# EAGLE design en76-vco2 (EAGLE 6.6.0)
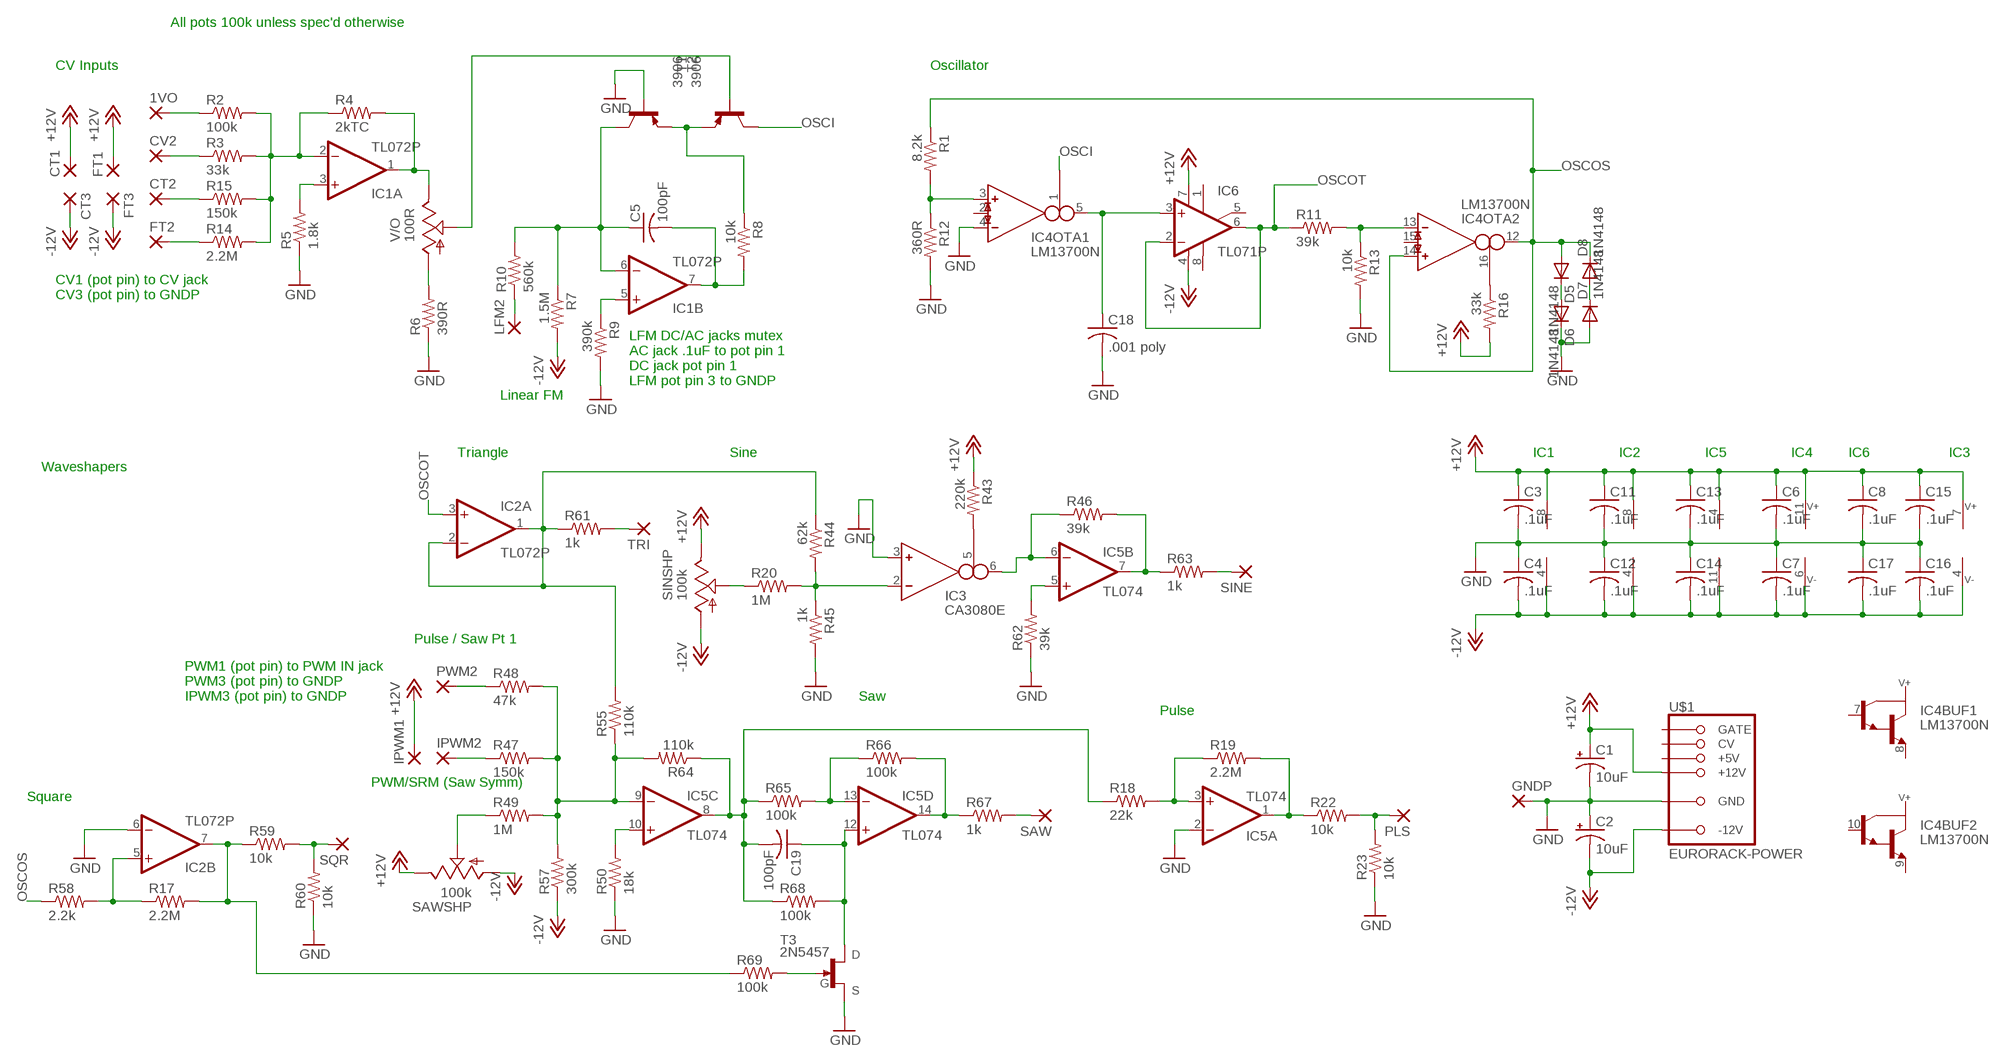
[diagram p0: schematic, sheet 1]

## Parts
1VO  2,54/1,0  [2,54/1,0]
C1  10uF  CPOL-USE2-5  [E2-5]
C2  10uF  CPOL-USE2-5  [E2-5]
C3  .1uF  C-US050-025X075  [C050-025X075]
C4  .1uF  C-US050-025X075  [C050-025X075]
C5  100pF  C-US050-025X075  [C050-025X075]
C6  .1uF  C-US050-025X075  [C050-025X075]
C7  .1uF  C-US050-025X075  [C050-025X075]
C8  .1uF  C-US050-025X075  [C050-025X075]
C11  .1uF  C-US050-025X075  [C050-025X075]
C12  .1uF  C-US050-025X075  [C050-025X075]
C13  .1uF  C-US050-025X075  [C050-025X075]
C14  .1uF  C-US050-025X075  [C050-025X075]
C15  .1uF  C-US050-025X075  [C050-025X075]
C16  .1uF  C-US050-025X075  [C050-025X075]
C17  .1uF  C-US050-025X075  [C050-025X075]
C18  .001 poly  C-US050-025X075  [C050-025X075]
C19  100pF  C-US050-025X075  [C050-025X075]
CT1  2,54/1,0  [2,54/1,0]
CT2  2,54/1,0  [2,54/1,0]
CT3  2,54/1,0  [2,54/1,0]
CV2  2,54/1,0  [2,54/1,0]
D5  1N4148  1N4148DO35-7  [DO35-7]
D6  1N4148  1N4148DO35-7  [DO35-7]
D7  1N4148  1N4148DO35-7  [DO35-7]
D8  1N4148  1N4148DO35-7  [DO35-7]
FT1  2,54/1,0  [2,54/1,0]
FT2  2,54/1,0  [2,54/1,0]
FT3  2,54/1,0  [2,54/1,0]
GNDP  2,54/1,0  [2,54/1,0]
IC1  TL072P  [DIL08]
IC2  TL072P  [DIL08]
IC3  CA3080E  [DIL08]
IC4  LM13700N  [DIL16]
IC5  TL074  TL074-TOPP  [DIL14]
IC6  TL071P  [DIL08]
IPWM1  2,54/1,0  [2,54/1,0]
IPWM2  2,54/1,0  [2,54/1,0]
LFM2  2,54/1,0  [2,54/1,0]
PLS  2,54/1,0  [2,54/1,0]
PWM2  2,54/1,0  [2,54/1,0]
R1  8.2k  R-US_0207/10  [0207/10]
R2  100k  R-US_0207/10  [0207/10]
R3  33k  R-US_0207/10  [0207/10]
R4  2kTC  R-US_0207/10  [0207/10]
R5  1.8k  R-US_0207/10  [0207/10]
R6  390R  R-US_0207/10  [0207/10]
R7  1.5M  R-US_0207/10  [0207/10]
R8  10k  R-US_0207/10  [0207/10]
R9  390k  R-US_0207/10  [0207/10]
R10  560k  R-US_0207/10  [0207/10]
R11  39k  R-US_0207/10  [0207/10]
R12  360R  R-US_0207/10  [0207/10]
R13  10k  R-US_0207/10  [0207/10]
R14  2.2M  R-US_0207/10  [0207/10]
R15  150k  R-US_0207/10  [0207/10]
R16  33k  R-US_0207/10  [0207/10]
R17  2.2M  R-US_0207/10  [0207/10]
R18  22k  R-US_0207/10  [0207/10]
R19  2.2M  R-US_0207/10  [0207/10]
R20  1M  R-US_0207/10  [0207/10]
R22  10k  R-US_0207/10  [0207/10]
R23  10k  R-US_0207/10  [0207/10]
R43  220k  R-US_0207/10  [0207/10]
R44  62k  R-US_0207/10  [0207/10]
R45  1k  R-US_0207/10  [0207/10]
R46  39k  R-US_0207/10  [0207/10]
R47  150k  R-US_0207/10  [0207/10]
R48  47k  R-US_0207/10  [0207/10]
R49  1M  R-US_0207/10  [0207/10]
R50  18k  R-US_0207/10  [0207/10]
R55  110k  R-US_0207/10  [0207/10]
R57  300k  R-US_0207/10  [0207/10]
R58  2.2k  R-US_0207/10  [0207/10]
R59  10k  R-US_0207/10  [0207/10]
R60  10k  R-US_0207/10  [0207/10]
R61  1k  R-US_0207/10  [0207/10]
R62  39k  R-US_0207/10  [0207/10]
R63  1k  R-US_0207/10  [0207/10]
R64  110k  R-US_0207/10  [0207/10]
R65  100k  R-US_0207/10  [0207/10]
R66  100k  R-US_0207/10  [0207/10]
R67  1k  R-US_0207/10  [0207/10]
R68  100k  R-US_0207/10  [0207/10]
R69  100k  R-US_0207/10  [0207/10]
SAW  2,54/1,0  [2,54/1,0]
SAWSHP  100k  TRIM_US-RJ9W  [RJ9W]
SINE  2,54/1,0  [2,54/1,0]
SINSHP  100k  TRIM_US-RJ9W  [RJ9W]
SQR  2,54/1,0  [2,54/1,0]
T1  3906  2N3906-PNP-TO92-EBC  [TO92-EBC]
T2  3906  2N3906-PNP-TO92-EBC  [TO92-EBC]
T3  2N5457  [TO-92]
TRI  2,54/1,0  [2,54/1,0]
U$1  EURORACK-POWER  [PINSHRD_PTH_2X8]
V/O  100R  TRIM_US-RJ9W  [RJ9W]

## Nets
+12V: C1.+ C3.1 C6.1 C8.1 C11.1 C13.1 C15.1 CT1.1(P) FT1.1(P) IC1.8(P:V+) IC2.8(P:V+) IC3.7 IC4.11 IC5.4(P:V+) IC6.7(V+) IPWM1.1(P) R16.2 R43.1 SAWSHP.E SINSHP.E U$1.+12V@1(+12V) U$1.+12V@2(+12V)
-12V: C2.- C4.2 C7.2 C12.2 C14.2 C16.2 C17.2 CT3.1(P) FT3.1(P) IC1.4(P:V-) IC2.4(P:V-) IC3.4 IC4.6 IC5.11(P:V-) IC6.4(V-) R7.2 R57.1 SAWSHP.A SINSHP.A U$1.-12V@1(-12V) U$1.-12V@2(-12V)
GND: C1.- C2.+ C3.2 C4.1 C6.2 C7.1 C8.2 C11.2 C12.1 C13.2 C14.1 C15.2 C16.1 C17.1 C18.2 D6.C D7.A GNDP.1(P) IC2.6(B:-IN) IC3.3(IN_P) IC4.4(OTA1:IN_N) IC5.2(A:-IN) R5.1 R6.1 R9.2 R12.2 R13.2 R23.1 R45.2 R50.1 R60.1 R62.1 T2.B T3.2(S) U$1.GND@1(GND) U$1.GND@2(GND) U$1.GND@3(GND) U$1.GND@4(GND) U$1.GND@5(GND) U$1.GND@6(GND)
N$1: CT2.1(P) R15.1
N$2: CV2.1(P) R3.1
N$3: 1VO.1(P) R2.1
N$4: T1.B V/O.S
N$5: IC1.3(A:+IN) R5.2
N$6: IC1.2(A:-IN) R2.2 R3.2 R4.1 R14.2 R15.2
N$7: IC1.1(A:OUT) R4.2 V/O.E
N$8: R6.2 V/O.A
N$9: C5.1 IC1.6(B:-IN) R7.1 R10.2 T2.C
N$10: R8.1 T1.E T2.E
N$11: C5.2 IC1.7(B:OUT) R8.2
N$12: FT2.1(P) R14.1
N$13: LFM2.1(P) R10.1
N$14: IC1.5(B:+IN) R9.1
N$15: IC2.5(B:+IN) R17.1 R58.2
N$16: C18.1 IC4.5(OTA1:OUT) IC6.3(+IN)
N$17: IPWM2.1(P) R47.1
N$18: R59.2 R60.2 SQR.1(P)
N$19: IC5.9(C:-IN) R47.2 R48.2 R49.2 R55.1 R57.2 R64.2
N$20: IC4.3(OTA1:IN_P) R1.2 R12.1
N$21: IC4.13(OTA2:IN_N) R11.2 R13.1
N$22: R20.1 SINSHP.S
N$23: IC5.3(A:+IN) R18.2 R19.1
N$24: IC5.1(A:OUT) R19.2 R22.1
N$38: IC3.5(I_BIAS) R43.2
N$39: IC3.6(OUT) IC5.6(B:-IN) R46.1
N$40: IC3.2(IN_N) R20.2 R44.2 R45.1
N$43: PWM2.1(P) R48.1
N$44: R49.1 SAWSHP.S
N$45: IC5.10(C:+IN) R50.2
N$51: C19.2 IC5.8(C:OUT) R18.1 R64.1 R65.1 R68.1
N$52: IC4.16(OTA2:I_BIAS) R16.1
N$53: IC5.13(D:-IN) R65.2 R66.1
N$55: R61.2 TRI.1(P)
N$56: D5.C D6.A
N$57: D7.C D8.A
N$58: IC5.7(B:OUT) R46.2 R63.1
N$59: IC5.5(B:+IN) R62.2
N$60: R63.2 SINE.1(P)
N$61: R67.2 SAW.1(P)
N$62: IC5.14(D:OUT) R66.2 R67.1
N$63: C19.1 IC5.12(D:+IN) R68.2 T3.1(D)
N$64: R69.2 T3.3(G)
N$65: PLS.1(P) R22.2 R23.2
OSCI: IC4.1(OTA1:I_BIAS) T1.C
OSCOS: D5.A D8.C IC4.12(OTA2:OUT) IC4.14(OTA2:IN_P) R1.1 R58.1
OSCOT: IC2.3(A:+IN) IC6.2(-IN) IC6.6(OUT) R11.1
SQX: IC2.7(B:OUT) R17.2 R59.1 R69.1
TRIANGLE: IC2.1(A:OUT) IC2.2(A:-IN) R44.1 R55.2 R61.1
Unconnected: IC4.2(OTA1:I_DIODE) IC4.7(BUF1:B) IC4.8(BUF1:E) IC4.9(BUF2:E) IC4.10(BUF2:B) IC4.15(OTA2:I_DIODE) IC6.1(ON1) IC6.5(ON2) IC6.8(OPT) U$1.+5V@1(+5V) U$1.+5V@2(+5V) U$1.CV@1(CV) U$1.CV@2(CV) U$1.GATE@1(GATE) U$1.GATE@2(GATE)

## Notes on the sheet
- All pots 100k unless spec'd otherwise
- CV Inputs | Oscillator
- CV1 (pot pin) to CV jack
  CV3 (pot pin) to GNDP
- LFM DC/AC jacks mutex
  AC jack .1uF to pot pin 1
  DC jack pot pin 1
  LFM pot pin 3 to GNDP
- Linear FM
- Triangle | Sine | IC1 | IC2 | IC5 | IC4 | IC6 | IC3
- Waveshapers
- Pulse / Saw Pt 1
- PWM1 (pot pin) to PWM IN jack
  PWM3 (pot pin) to GNDP
  IPWM3 (pot pin) to GNDP
- Saw
- Pulse
- PWM/SRM (Saw Symm)
- Square

## Library data of the parts
1VO CT1-CT3 CV2 FT1-FT3 GNDP IPWM1 IPWM2 LFM2 PLS PWM2 SAW SINE SQR TRI = wirepad:2,54/1,0: THROUGH-HOLE PAD
C1 C2 = rcl:CPOL-US: POLARIZED CAPACITOR, American symbol
C3-C8 C11-C19 = rcl:C-US: CAPACITOR, American symbol
D5-D8 = diode:1N4148: DIODE high speed (Philips)
IC1 IC2 = mmoretti:TL072: OP AMP
IC3 = mmoretti:CA3080: OTA
IC4 = mmoretti:LM13700: Dual OTA with buffers
IC5 = mmoretti:TL074-TOP: OP AMP
IC6 = mmoretti:TL071: OP AMP
R1-R20 R22 R23 R43-R50 R55 R57-R69 = rcl:R-US_: RESISTOR, American symbol
SAWSHP SINSHP V/O = pot:TRIM_US-: POTENTIOMETER
T1 T2 = transistor-neu-to92:*-PNP-: PNP Transistror
T3 = transistors-random:2N54*: 2N54xx N-channel JFET
U$1 = mmoretti:EURORACK-POWER

## Board
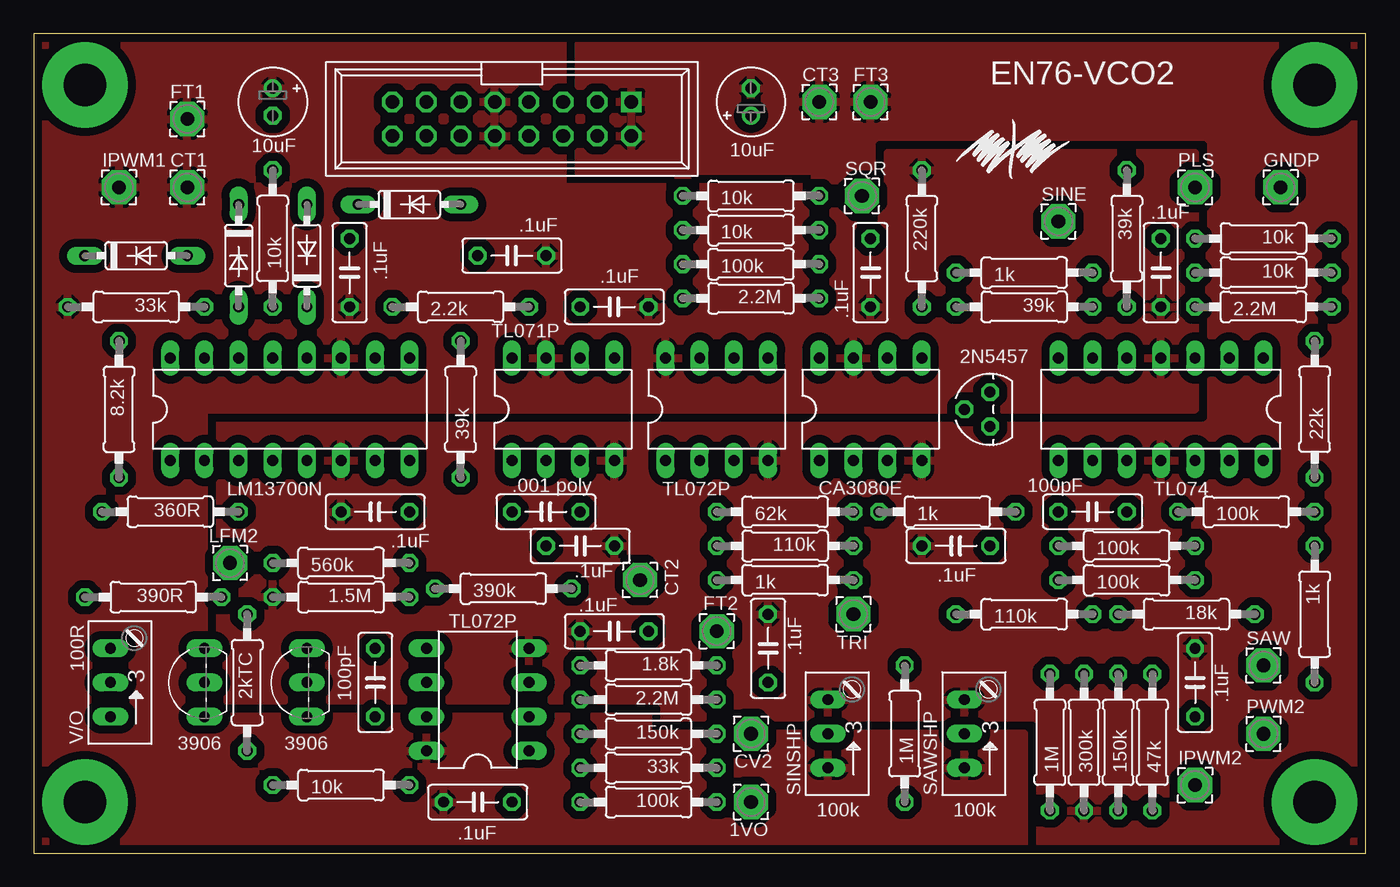
[diagram p1: board, top side]
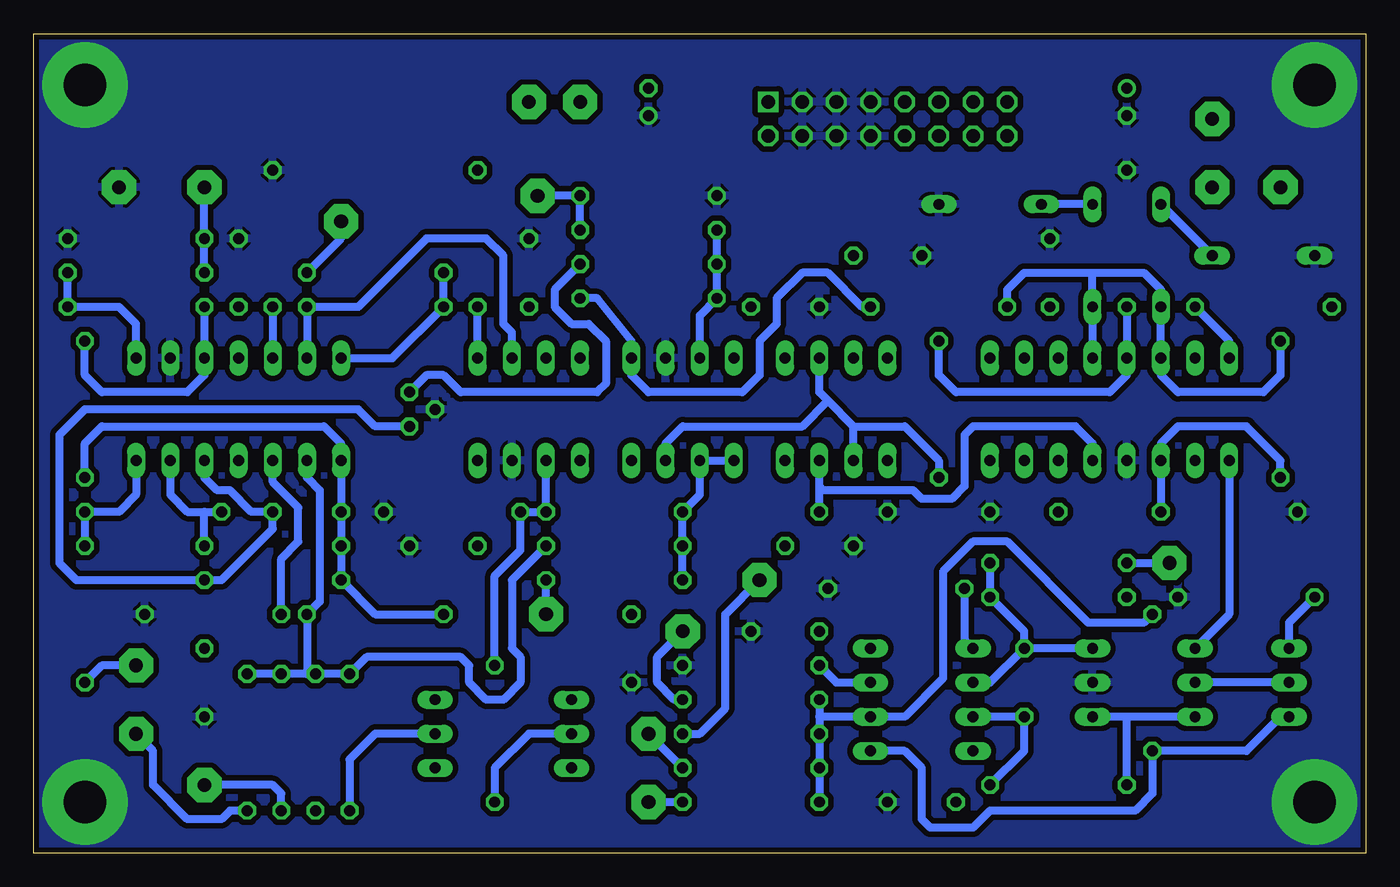
[diagram p2: board, bottom side, seen from below]

Size 99.06 x 60.96 mm. Coordinates in mm from the lower left corner, seen from the top.
Outline: 0,0 99.04,0 99.06,60.96 0,60.96 0,0
Copper layers (1*16): Top 0.035mm / dielectric 1.5mm / Bottom 0.035mm
Design rules "SeeedStudio_2layer_DRU_no_angle_20140221": minimum track width 6mil, minimum drill 12mil, track to track 6mil, track to pad 6mil, pad to pad 6mil, via to via 6mil, smd to smd 0mil, copper to edge 10mil, drill to drill 10mil, minimum pad ring 10mil, minimum via ring 6mil, stop-mask expansion 2mil, vias tented up to drill 100mil, thermal gap 10mil

### Footprints (pad centres in the part's own frame; a part is rotated, then mirrored left to right if it is on the bottom)
2,54/1,0 = drill 1.016 pad 2.54 octagon: 1 0,0
E2-5 = drill 0.813 pad 1.27: + -1.016,0 | drill 0.813 pad 1.27 octagon: - 1.016,0
C050-025X075 = drill 0.813 octagon: 1 -2.54,0; 2 2.54,0
DO35-7 = drill 0.813 long: A 3.81,0; C -3.81,0
DIL08 = drill 0.813 long: 1 -3.81,-3.81; 2 -1.27,-3.81; 3 1.27,-3.81; 4 3.81,-3.81; 5 3.81,3.81; 6 1.27,3.81; 7 -1.27,3.81; 8 -3.81,3.81
DIL16 = drill 0.813 long: 1 -8.89,-3.81; 2 -6.35,-3.81; 3 -3.81,-3.81; 4 -1.27,-3.81; 5 1.27,-3.81; 6 3.81,-3.81; 7 6.35,-3.81; 8 8.89,-3.81; 9 8.89,3.81; 10 6.35,3.81; 11 3.81,3.81; 12 1.27,3.81; 13 -1.27,3.81; 14 -3.81,3.81; 15 -6.35,3.81; 16 -8.89,3.81
DIL14 = drill 0.813 long: 1 -7.62,-3.81; 2 -5.08,-3.81; 3 -2.54,-3.81; 4 0,-3.81; 5 2.54,-3.81; 6 5.08,-3.81; 7 7.62,-3.81; 8 7.62,3.81; 9 5.08,3.81; 10 2.54,3.81; 11 0,3.81; 12 -2.54,3.81; 13 -5.08,3.81; 14 -7.62,3.81
0207/10 = drill 0.813 octagon: 1 -5.08,0; 2 5.08,0
RJ9W = drill 0.813 long: A 2.54,0.635; E -2.54,0.635; S 0,0.635
TO92-EBC = drill 0.813 long: B 0,-1.27; C 2.54,-1.27; E -2.54,-1.27
TO-92 = drill 0.813 octagon: 1 -1.27,0; 2 0,1.905; 3 1.27,0
PINSHRD_PTH_2X8 = drill 1.016 octagon: +5V@1 3.81,1.27; +5V@2 3.81,-1.27; +12V@1 1.27,1.27; +12V@2 1.27,-1.27; -12V@1 -8.89,1.27; CV@1 6.35,1.27; CV@2 6.35,-1.27; GATE@1 8.89,1.27; GATE@2 8.89,-1.27; GND@1 -6.35,1.27; GND@2 -6.35,-1.27; GND@3 -3.81,1.27; GND@4 -3.81,-1.27; GND@5 -1.27,1.27; GND@6 -1.27,-1.27 | drill 1.016 square: -12V@2 -8.89,-1.27

### Placement (x,y rotation side)
1VO  53.34,3.81 180 top
C1  17.78,55.88 270 top
C2  53.34,55.88 90 top
C3  33.02,3.81 0 top
C4  43.18,16.51 180 top
C5  25.4,12.7 270 top
C6  23.5,43.18 90 top
C7  25.4,25.4 180 top
C8  35.56,44.45 180 top
C11  43.18,40.64 180 top
C12  54.61,15.24 90 top
C13  83.82,43.18 90 top
C14  86.36,12.7 90 top
C15  62.23,43.18 90 top
C16  68.58,22.86 180 top
C17  40.64,22.86 0 top
C18  38.1,25.4 180 top
C19  78.74,25.4 180 top
CT1  11.43,49.53 0 top
CT2  45.09,20.32 180 top
CT3  58.42,55.88 0 top
CV2  53.34,8.89 180 top
D5  15.24,44.45 270 top
D6  7.62,44.45 0 top
D7  27.94,48.26 0 top
D8  20.32,44.45 90 top
FT1  11.43,54.61 0 top
FT2  50.8,16.51 180 top
FT3  62.23,55.88 0 top
GNDP  92.71,49.53 0 top
IC1  33.02,11.43 90 top
IC2  50.8,33.02 0 top
IC3  62.23,33.02 0 top
IC4  19.05,33.02 0 top
IC5  83.82,33.02 180 top
IC6  39.37,33.02 0 top
IPWM1  6.35,49.53 0 top
IPWM2  86.36,5.08 0 top
LFM2  14.61,21.59 270 top
PLS  86.36,49.53 0 top
PWM2  91.44,8.89 0 top
R1  6.35,33.02 270 top
R2  45.72,3.81 180 top
R3  45.72,6.35 180 top
R4  15.88,12.7 270 top
R5  45.72,13.97 180 top
R6  8.89,19.05 180 top
R7  22.86,19.05 180 top
R8  22.86,5.08 0 top
R9  34.92,19.68 0 top
R10  22.86,21.59 0 top
R11  31.75,33.02 90 top
R12  10.16,25.4 180 top
R13  17.78,45.72 90 top
R14  45.72,11.43 180 top
R15  45.72,8.89 180 top
R16  7.62,40.64 180 top
R17  53.34,41.27 180 top
R18  95.25,33.02 90 top
R19  91.44,40.64 0 top
R20  64.77,8.89 90 top
R22  91.44,43.18 180 top
R23  91.44,45.72 180 top
R43  66.04,45.72 270 top
R44  55.88,25.4 0 top
R45  67.94,25.4 0 top
R46  73.66,40.64 180 top
R47  80.64,8.26 90 top
R48  83.19,8.26 90 top
R49  75.56,8.26 90 top
R50  85.72,17.78 180 top
R55  55.88,22.86 180 top
R57  78.11,8.26 90 top
R58  31.75,40.64 0 top
R59  53.34,46.35 0 top
R60  53.34,48.9 0 top
R61  55.88,20.32 0 top
R62  81.28,45.72 270 top
R63  73.66,43.18 0 top
R64  73.66,17.78 0 top
R65  81.28,22.86 0 top
R66  90.17,25.4 0 top
R67  95.25,17.78 270 top
R68  81.28,20.32 0 top
R69  53.34,43.81 0 top
SAW  91.44,13.97 0 top
SAWSHP  69.85,8.89 90 top
SINE  76.2,46.99 0 top
SINSHP  59.69,8.89 90 top
SQR  61.59,48.9 0 top
T1  11.43,12.7 90 top
T2  19.05,12.7 90 top
T3  71.12,33.02 90 top
TRI  60.96,17.78 0 top
U$1  35.56,54.61 180 top
V/O  6.35,12.7 90 top

### Tracks (layer width: path | path; a pad name or v marks a point on that pad's centre or on a via)
+12V
  pour Top (isolate 0.61): 0,60.96 0,0 73.66,0 73.66,8.89 45.72,8.89 45.72,10.16 12.7,10.16 12.7,33.02 86.36,33.02 86.36,52.07 63.5,52.07 63.5,49.53 39.37,49.53 39.37,60.96
-12V
  pour Top (isolate 0.61, rank 2): 39.37,60.96 99.06,60.96 99.06,0 73.66,0 73.66,8.89 45.72,8.89 45.72,10.16 12.7,10.16 12.7,33.02 86.36,33.02 86.36,52.07 63.5,52.07 63.5,49.53 39.37,49.53
GND  (via drill 3.17 pad 6.35)
  other vias: 3.81,57.15 3.81,3.81 95.25,57.15 95.25,3.81
  pour Bottom (isolate 0.406): 0,60.96 99.06,60.96 99.06,0 0,0
N$1
  Bottom 0.61: R15.1 49.53,8.89 47.62,10.79 47.62,17.78 CT2.1
N$2
  Bottom 0.61: R3.1 CV2.1
N$3
  Bottom 0.61: R2.1 1VO.1
N$4
  Bottom 0.61: V/O.S T1.B
N$5
  Bottom 0.61: R5.2 39.37,12.7 IC1.3
N$6
  Bottom 0.61: R4.1 16.51,17.14 20.64,17.14 26.67,23.18 29.21,23.18 31.43,20.95 31.43,13.02 34.29,10.16 IC1.2 40.64,10.16 | R14.2 40.64,10.16 | 40.64,10.16 R15.2 R3.2 R2.2
N$7
  Bottom 0.61: V/O.E 6.35,10.16 8.89,7.62 R4.2 15.88,4.45 17.14,3.17 27.94,3.17 29.21,1.91 32.38,1.91 33.02,2.54 33.02,6.35 34.29,7.62 IC1.1
N$8
  Bottom 0.61: R6.2 5.71,17.14 V/O.A
N$9
  Bottom 0.61: T2.C C5.1 | R10.2 R7.1 25.4,16.51 C5.1 | IC1.6 27.94,12.7 C5.1
N$10
  Bottom 0.61: T1.E 17.78,10.16 | 17.78,10.16 T2.E | R8.1 17.78,10.16
N$11
  Bottom 0.61: IC1.7 C5.2 25.4,7.62 R8.2
N$12
  Bottom 0.61: R14.1 51.44,11.43 52.7,12.7 52.7,14.61 FT2.1
N$13
  Bottom 0.61: R10.1 LFM2.1
N$14
  Bottom 0.61: R9.1 29.84,15.88 IC1.5
N$15
  Bottom 0.61: R58.2 37.47,40.64 40.01,43.18 41.91,43.18 43.81,41.27 43.81,39.37 45.09,38.1 45.09,35.56 46.35,34.29 53.34,34.29 54.61,35.56 IC2.5 54.61,38.1 57.15,41.27 R17.1
N$16
  Bottom 0.61: C18.1 40.64,27.3 | 40.64,27.3 IC6.3 | IC4.5 20.32,30.48 21.59,31.75 29.21,31.75 29.84,31.11 29.84,27.3 30.8,26.35 33.02,26.35 33.66,26.99 40.32,26.99 40.64,27.3
N$17
  Bottom 0.61: R47.1 80.64,4.45 81.28,5.08 IPWM2.1
N$18
  Bottom 0.61: R59.2 R60.2 SQR.1
N$19
  Bottom 0.61: R55.1 63.5,20.32 63.5,15.24 62.87,14.61 62.87,12.7 64.14,11.43 65.41,11.43 66.67,12.7 66.67,13.97 67.31,14.61 74.3,14.61 R49.2 R57.2 78.74,13.34 | 78.74,13.34 R47.2 R48.2 | 78.74,13.34 R64.2 77.79,18.73 77.79,26.99 78.74,27.94 IC5.9
N$20
  Bottom 0.61: R1.2 6.35,29.21 8.89,31.75 13.97,31.75 15.24,30.48 IC4.3 R12.1
N$21
  Bottom 0.61: R13.1 IC4.13 17.78,35.56 19.05,34.29 30.48,34.29 31.75,35.56 R11.2
N$22
  Bottom 0.61: SINSHP.S 62.23,8.89 64.77,6.35 R20.1
N$23
  Bottom 0.61: R19.1 IC5.3 86.36,35.56 87.63,34.29 93.98,34.29 95.25,35.56 R18.2
N$24
  Bottom 0.61: IC5.1 91.44,39.37 92.71,40.64 R19.2 R22.1
N$38
  Bottom 0.61: IC3.5 R43.2
N$39
  Bottom 0.61: IC3.6 63.5,38.73 64.14,39.37 64.14,44.45 65.41,45.72 69.85,45.72 74.93,40.64 R46.1 IC5.6
N$40
  Bottom 0.61: R20.2 64.77,20.64 62.87,22.54 R45.1 R44.2 IC3.2
N$43
  Bottom 0.61: R48.1 84.45,3.17 85.09,2.54 87.63,2.54 90.17,5.08 90.17,7.62 PWM2.1
N$44
  Bottom 0.61: SAWSHP.S 73.66,8.89 75.56,6.99 R49.1
N$45
  Bottom 0.61: R50.2 80.64,21.91 79.38,23.18 79.38,25.72 81.28,27.62 IC5.10
N$51
  Bottom 0.61: R18.1 95.25,30.48 93.98,31.75 77.47,31.75 76.2,30.48 IC5.8 C19.2 R65.1 R68.1 73.66,17.78 R64.1
N$52
  Bottom 0.61: IC4.16 10.16,38.1 R16.1
N$53
  Bottom 0.61: IC5.13 88.9,26.67 87.63,25.4 86.36,25.4 | 86.36,25.4 R66.1 | R65.2 86.36,25.4
N$55
  Bottom 0.61: TRI.1 R61.2
N$56
  Bottom 0.61: D5.C D6.A
N$57
  Bottom 0.61: D8.A D7.C
N$58
  Bottom 0.61: IC5.7 72.39,36.83 R46.2 R63.1
N$59
  Bottom 0.61: R62.2 IC5.5
N$60
  Bottom 0.61: R63.2 76.2,45.72 SINE.1
N$61
  Bottom 0.61: SAW.1 93.98,13.97 R67.2
N$62
  Bottom 0.61: IC5.14 91.44,26.67 92.71,25.4 R66.2 R67.1
N$63
  Bottom 0.61: IC5.12 86.36,27.94 85.41,26.99 84.45,26.99 82.87,25.4 C19.1 81.28,24.13 85.09,20.32 R68.2 95.89,20.32 97.16,21.59 97.16,31.11 95.25,33.02 74.93,33.02 73.66,31.75 T3.1
N$64
  Bottom 0.61: R69.2 60.33,41.91 60.33,40.64 59.05,39.37 57.78,39.37 56.52,38.1 56.52,34.92 57.15,34.29 67.31,34.29 68.58,35.56 69.85,35.56 T3.3
N$65
  Bottom 0.61: R22.2 R23.2 PLS.1
OSCI
  Bottom 0.61: IC4.1 10.16,17.78 T1.C
OSCOS
  Bottom 0.61: R1.1 6.35,35.56 7.62,34.29 13.97,34.29 15.24,35.56 IC4.14 D5.A 15.24,41.91 16.51,43.18 20.32,43.18 | IC4.12 D8.C 20.32,43.18 | R58.1 26.67,41.91 25.4,43.18 20.32,43.18
OSCOT
  Bottom 0.61: 38.1,31.75 40.01,33.66 | 40.01,33.66 40.64,34.29 IC6.6 | IC6.2 38.1,31.75 | IC2.3 52.07,30.48 50.8,31.75 41.91,31.75 40.01,33.66 | 38.1,31.75 34.29,31.75 31.75,29.21 R11.1
SQX
  Bottom 0.61: IC2.7 49.53,40.01 R17.2 R69.1 R59.1
TRIANGLE
  Bottom 0.61: R61.1 R55.2 R44.1 49.53,26.67 IC2.2 IC2.1

### Text on the board
tPlace: EN76-VCO2